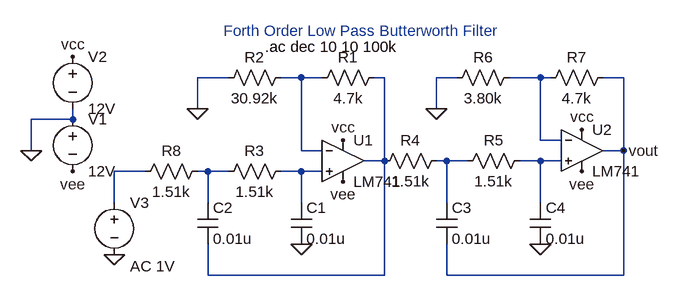
[diagram p0: schematic forthorderlowpass.asc]
forthorderlowpass.asc, the LTspice schematic file:
Version 4.1
SHEET 1 880 680
WIRE 80 32 32 32
WIRE 192 32 160 32
WIRE 224 32 192 32
WIRE 320 32 304 32
WIRE 432 32 400 32
WIRE 560 32 512 32
WIRE 576 32 560 32
WIRE 688 32 656 32
WIRE 32 80 32 32
WIRE 400 80 400 32
WIRE -160 96 -160 80
WIRE -160 96 -224 96
WIRE 560 128 560 32
WIRE 592 128 560 128
WIRE -224 144 -224 96
WIRE 192 144 192 32
WIRE 224 144 192 144
WIRE 688 144 688 32
WIRE 688 144 656 144
WIRE 320 160 320 32
WIRE 320 160 288 160
WIRE 416 160 400 160
WIRE 448 160 416 160
WIRE 560 160 528 160
WIRE 592 160 560 160
WIRE -48 176 -96 176
WIRE 48 176 32 176
WIRE 80 176 48 176
WIRE 192 176 160 176
WIRE 224 176 192 176
WIRE -96 224 -96 176
WIRE 48 224 48 176
WIRE 192 224 192 176
WIRE 416 224 416 160
WIRE 560 224 560 160
WIRE 48 336 48 288
WIRE 320 336 320 160
WIRE 320 336 48 336
WIRE 416 336 416 288
WIRE 688 336 688 144
WIRE 688 336 416 336
FLAG -224 144 0
FLAG 256 128 vcc
FLAG -160 0 vcc
FLAG 624 112 vcc
FLAG -160 176 vee
FLAG 256 192 vee
FLAG 624 176 vee
FLAG -96 304 0
FLAG 192 288 0
FLAG 560 288 0
FLAG 32 80 0
FLAG 400 80 0
FLAG 688 144 vout
SYMBOL voltage -160 80 R0
WINDOW 123 0 0 Left 0
WINDOW 39 0 0 Left 0
SYMATTR InstName V1
SYMATTR Value 12V
SYMBOL voltage -160 -16 R0
WINDOW 123 0 0 Left 0
WINDOW 39 0 0 Left 0
SYMATTR InstName V2
SYMATTR Value 12V
SYMBOL LM741 256 96 R0
SYMATTR InstName U1
SYMBOL LM741 624 80 R0
SYMATTR InstName U2
SYMBOL res 320 16 R90
WINDOW 0 0 56 VBottom 2
WINDOW 3 32 56 VTop 2
SYMATTR InstName R1
SYMATTR Value 4.7k
SYMBOL res 176 16 R90
WINDOW 0 0 56 VBottom 2
WINDOW 3 32 56 VTop 2
SYMATTR InstName R2
SYMATTR Value 30.92k
SYMBOL res 176 160 R90
WINDOW 0 0 56 VBottom 2
WINDOW 3 32 56 VTop 2
SYMATTR InstName R3
SYMATTR Value 1.51k
SYMBOL res 416 144 R90
WINDOW 0 0 56 VBottom 2
WINDOW 3 32 56 VTop 2
SYMATTR InstName R4
SYMATTR Value 1.51k
SYMBOL res 544 144 R90
WINDOW 0 0 56 VBottom 2
WINDOW 3 32 56 VTop 2
SYMATTR InstName R5
SYMATTR Value 1.51k
SYMBOL res 528 16 R90
WINDOW 0 0 56 VBottom 2
WINDOW 3 32 56 VTop 2
SYMATTR InstName R6
SYMATTR Value 3.80k
SYMBOL res 672 16 R90
WINDOW 0 0 56 VBottom 2
WINDOW 3 32 56 VTop 2
SYMATTR InstName R7
SYMATTR Value 4.7k
SYMBOL res 48 160 R90
WINDOW 0 0 56 VBottom 2
WINDOW 3 32 56 VTop 2
SYMATTR InstName R8
SYMATTR Value 1.51k
SYMBOL cap 176 224 R0
SYMATTR InstName C1
SYMATTR Value 0.01u
SYMBOL cap 32 224 R0
SYMATTR InstName C2
SYMATTR Value 0.01u
SYMBOL cap 400 224 R0
SYMATTR InstName C3
SYMATTR Value 0.01u
SYMBOL cap 544 224 R0
SYMATTR InstName C4
SYMATTR Value 0.01u
SYMBOL voltage -96 208 R0
WINDOW 123 24 114 Left 2
WINDOW 39 0 0 Left 0
SYMATTR InstName V3
SYMATTR Value ""
SYMATTR Value2 AC 1V
TEXT 72 -40 Left 2 ;Forth Order Low Pass Butterworth Filter
TEXT 136 -16 Left 2 !.ac dec 10 10 100k

The netlist it stands for:
* forthorderlowpass.asc
V1 0 vee 12V
V2 vcc 0 12V
X§U1 N008 N001 vcc vee N002 LM741  ; pins In+ In- V+ V- OUT
X§U2 N005 N003 vcc vee vout LM741  ; pins In+ In- V+ V- OUT
R1 N002 N001 4.7k
R2 N001 0 30.92k
R3 N008 N007 1.51k
R4 N004 N002 1.51k
R5 N005 N004 1.51k
R6 N003 0 3.80k
R7 vout N003 4.7k
R8 N007 N006 1.51k
C1 N008 0 0.01u
C2 N007 N002 0.01u
C3 N004 vout 0.01u
C4 N005 0 0.01u
V3 N006 0 AC 1V
* Forth Order Low Pass Butterworth Filter
.ac dec 10 10 100k
.lib LM741.lib
.backanno
.end